# Altium schematic sheet Thermistor_Interface.SchDoc: Title
size B; Organization: Midnight Sun Solar Rayce Car Team; Address1: University of Waterloo; Address2: 200 University Ave W; Address3: Waterloo, ON, Canada; Address4: N2L 3E9; Website: www.uwmidsun.com; ProjectName: ProjectName
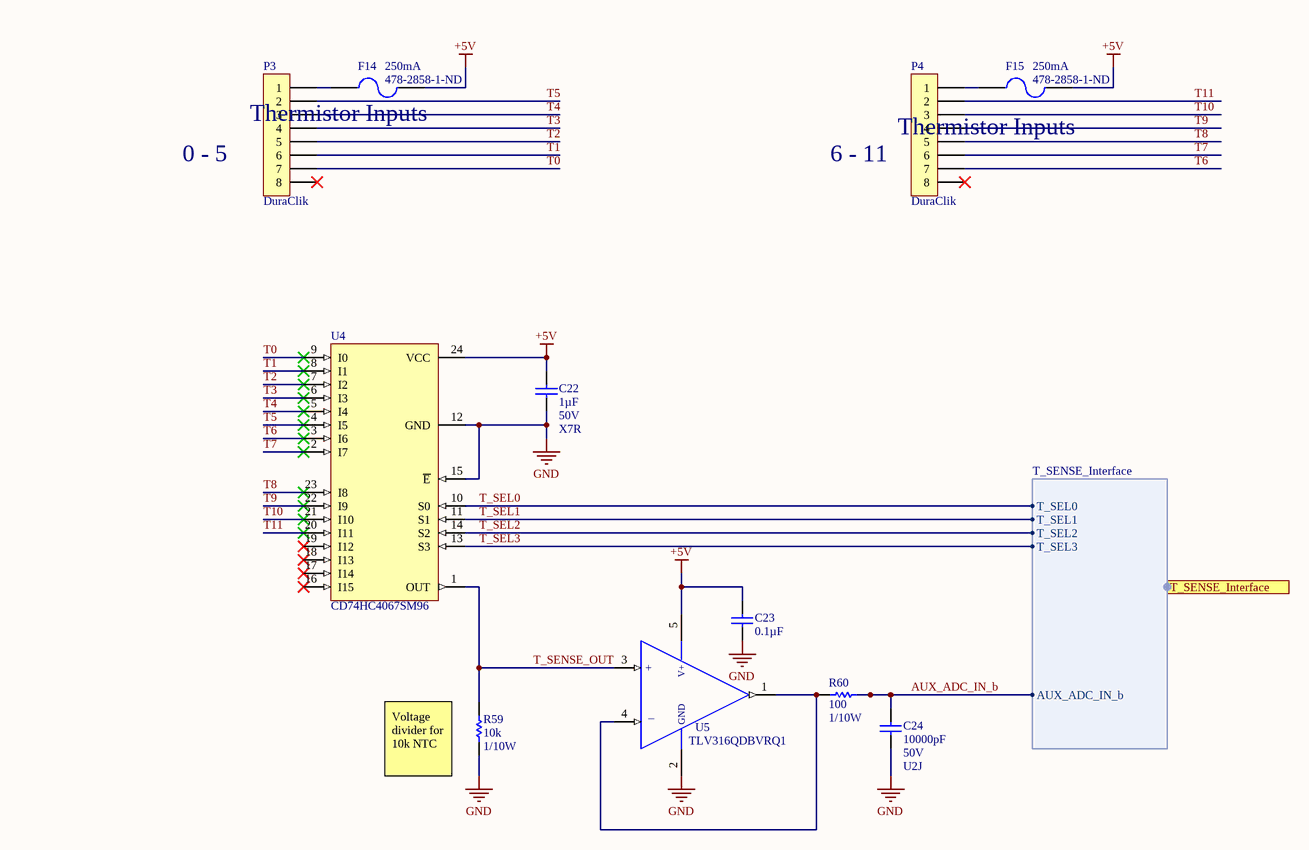
[diagram p0: Thermistor_Interface.SchDoc]

## Parts
C22  Capacitance: 1µF  Voltage: 50V  Temperature Coefficient: X7R  [CAP, 0603]  (hidden comment: CAP CER 1UF 50V 10% X7R 0603)
C23  Capacitance: 0.1µF  [CAP, 0603]  (hidden comment: CAP CER 0.1UF 50V 10% X7R 0603)
C24  Capacitance: 10000pF  Voltage: 50V  Temperature Coefficient: U2J  [CAP, 0603]  (hidden comment: CAP CER 10nF 50V 5% X7R 0603)
F14  Fuse Current: 250mA  Supplier Part Number 1: 478-2858-1-ND  [RES, 0603]  (hidden comment: FUSE 250MA 32VDC 0603)
F15  Fuse Current: 250mA  Supplier Part Number 1: 478-2858-1-ND  [RES, 0603]  (hidden comment: FUSE 250MA 32VDC 0603)
P3  Series: DuraClik  [CONN, 8POS Dura-Clik]  (hidden comment: CONN 8POS DURA-CLIK 0.079")
P4  Series: DuraClik  [CONN, 8POS Dura-Clik]  (hidden comment: CONN 8POS DURA-CLIK 0.079")
R59  Resistance: 10k  Power: 1/10W  [RES, 0603]  (hidden comment: RES 10K OHM 1% 1/10W 0603)
R60  Resistance: 100  Power: 1/10W  [RES, 0603]  (hidden comment: RES 100 OHM 1% 1/10W 0603)
U4  Manufacturer Part Number 1: CD74HC4067SM96  [SSOP-24_GN]  (hidden comment: IC MUX/DEMUX 1X16 24SSOP)
U5  Manufacturer Part Number 1: TLV316QDBVRQ1  [IC OP AMP GP RR 10MHZ SOT-23-5]  (hidden comment: IC OP AMP GEN PURPOSE RR 10MHZ SOT-23-5)

## Ports
T_SENSE_Interface (harness T_SENSE_Interface)

## Harnesses
T_SENSE_Interface: AUX_ADC_IN_b, T_SEL0, T_SEL1, T_SEL2, T_SEL3

## Nets
+5V: C22.1 C23.1 F14.2 F15.2 U4.24(VCC) U5.5(VDD)
GND: C22.2 C23.2 C24.2 R59.2 U4.12(GND) U4.15(~{E}) U5.2(VSS)
AUX_ADC_IN_b: C24.1 R60.2 ; port T_SENSE_Interface.AUX_ADC_IN_b
T0: P3.7 U4.9(I0)
T1: P3.6 U4.8(I1)
T2: P3.5 U4.7(I2)
T3: P3.4 U4.6(I3)
T4: P3.3 U4.5(I4)
T5: P3.2 U4.4(I5)
T6: P4.7 U4.3(I6)
T7: P4.6 U4.2(I7)
T8: P4.5 U4.23(I8)
T9: P4.4 U4.22(I9)
T10: P4.3 U4.21(I10)
T11: P4.2 U4.20(I11)
T_SEL0: U4.10(S0) ; port T_SENSE_Interface.T_SEL0
T_SEL1: U4.11(S1) ; port T_SENSE_Interface.T_SEL1
T_SEL2: U4.14(S2) ; port T_SENSE_Interface.T_SEL2
T_SEL3: U4.13(S3) ; port T_SENSE_Interface.T_SEL3
T_SENSE_OUT: R59.1 U4.1(OUT) U5.3(+IN)
NetF14_1: F14.1 P3.1
NetF15_1: F15.1 P4.1
NetR60_1: R60.1 U5.1(OUTPUT) U5.4(-IN)

Not connected (* = marked no-connect by the designer): P3 8*; P4 8*; U4 16(I15)* 17(I14)* 18(I13)* 19(I12)*

## Notes on the sheet
- 0 - 5
- (near P3) Thermistor Inputs
- 6 - 11
- (near P4) Thermistor Inputs
- (near R59) Voltage divider for 10k NTC
- PROJECT
- DOCUMENT
- DRAWN BY
- LAST MODIFIED
- PART NUMBER
- REVISION
- SHEET
- VARIANT
- OF
- Engineering 5 - 1002
  University of Waterloo
  (519) 888-4567 x32978
  hardware@uwmidsun.com
- (in symbol IC OP AMP GEN PURPOSE RR 10MHZ SOT-23-5) V+; +; GND; _

## Library data of the parts
C22 = CAP CER 1UF 50V 10% X7R 0603: 1µF ±10% 50V Ceramic Capacitor X7R 0603 (1608 Metric); Manufacturer 1: Taiyo Yuden; Manufacturer Part Number 1: UMK107AB7105KA-T; Supplier 1: Digi-Key; Supplier Part Number 1: 587-3247-1-ND; Packaging: Cut Tape (CT); Part Status: Active; Operating Temperature: -55°C ~ 125°C; Ratings: -; Mounting Type: Surface Mount, MLCC; Package / Case: 0603 (1608 Metric); Size / Dimension: 0.063" L x 0.031" W (1.60mm x 0.80mm); Height - Seated (Max): -; Thickness (Max): 0.037" (0.95mm); Lead Spacing: -; Lead Style: -; ComponentLink1URL: http://www.yuden.co.jp/productdata/catalog/en/mlcc_all_e.pdf; ComponentLink1Description: http://www.yuden.co.jp/productdata/catalog/en/mlcc_all_e.pdf; Tolerance: ±10%
C23 = CAP CER 0.1UF 50V 10% X7R 0603: 0.10µF ±10% 50V Ceramic Capacitor X7R 0603 (1608 Metric); Manufacturer 1: AVX Corporation; Manufacturer Part Number 1: 06035C104KAT2A; Supplier 1: Digi-Key; Supplier Part Number 1: 478-5052-1-ND; Packaging: Cut Tape (CT); Part Status: Active; Operating Temperature: -55°C ~ 125°C; Ratings: -; Mounting Type: Surface Mount, MLCC; Package / Case: 0603 (1608 Metric); Size / Dimension: 0.063" L x 0.032" W (1.60mm x 0.81mm); Height - Seated (Max): -; Thickness (Max): 0.035" (0.90mm); Lead Spacing: -; Lead Style: -; ComponentLink1URL: http://datasheets.avx.com/X7RDielectric.pdf; ComponentLink1Description: http://datasheets.avx.com/X7RDielectric.pdf; Tolerance: ±10%; Voltage: 50V; Temperature Coefficient: X7R
C24 = CAP CER 10nF 50V 5% X7R 0603: 10000pF ±5% 50V Ceramic Capacitor U2J 0603 (1608 Metric); Manufacturer 1: KEMET; Manufacturer Part Number 1: C0603C103J5JAC7867; Supplier 1: Digi-Key; Supplier Part Number 1: 399-13384-1-ND; Packaging: Cut Tape (CT); Part Status: Active; Operating Temperature: -55°C ~ 125°C; Ratings: -; Failure Rate: -; Mounting Type: Surface Mount, MLCC; Package / Case: 0603 (1608 Metric); Size / Dimension: 0.063" L x 0.032" W (1.60mm x 0.80mm); Height - Seated (Max): -; Thickness (Max): 0.034" (0.87mm); Lead Spacing: -; Lead Style: -; ComponentLink1URL: http://www.kemet.com/docfinder?Partnumber=C0603C103J5JAC7867; ComponentLink1Description: http://www.kemet.com/docfinder?Partnumber=C0603C103J5JAC7867; Tolerance: ±5%
F14 F15 = FUSE 250MA 32VDC 0603: Manufacturer: Kyocera AVX; Manufacturer Part Number: F0603E0R25FSTR; Voltage Rating (DC): 32V; Resistance: 650mR; Fuse Type: Board Mount (Cartridge Style Excluded); Approvals: UL; Supplier 1: Digi-Key; Stock 1: 48569; Pricing 1: 1=0.41, 5=0.394, 10=0.381, 50=0.3206, 100=0.2662, 250=0.242, 500=0.2057, 1000=0.1815 (USD); Mount: Surface Mount; Case/Package: 0603; Number of Pins: 2; Case Code (Metric): 1608; Case Code (Imperial): 0603; Contact Plating: Tin,Matte; Terminal Material: Nickel; Min Operating Temperature: -55°C; Max Operating Temperature: 125°C; Package Quantity: 1; Current Rating: 250mA; Packaging: Tape and Reel; Voltage Rating: 32V; Voltage Rating (AC): 32V; Max Voltage Rating (DC): 32V; DC Cold Resistance: 650mR; Composition: Thin Film; Length: 1.6mm; Height: 0.63mm; Width: 0.81mm; Depth: 0.81mm; Radiation Hardening: No; REACH SVHC: No SVHC; Lead Free: Lead Free; ComponentLink1URL: https://datasheet.ciiva.com/301/accug2-301328.pdf; ComponentLink1Description: https://datasheet.ciiva.com/301/accug2-301328.pdf; ComponentLink2URL: https://datasheet.ciiva.com/301/accug2-301329.pdf; ComponentLink2Description: https://datasheet.ciiva.com/301/accug2-301329.pdf; ComponentLink3URL: https://datasheet.ciiva.com/7650/accugrd-7650774.pdf; ComponentLink3Description: https://datasheet.ciiva.com/7650/accugrd-7650774.pdf; ComponentLink4URL: https://datasheet.ciiva.com/28473/1819437-28473548.pdf; ComponentLink4Description: https://datasheet.ciiva.com/28473/1819437-28473548.pdf; ComponentLink5URL: https://datasheet.ciiva.com/301/accug2-301327.pdf; ComponentLink5Description: https://datasheet.ciiva.com/301/accug2-301327.pdf
P3 P4 = CONN 8POS DURA-CLIK 0.079": 8 Positions Header Connector 0.079" (2.00mm) Surface Mount Tin; Manufacturer 1: Molex, LLC; Manufacturer Part Number 1: 5600200820; Style: Board to Cable/Wire; Shrouding: Shrouded - 4 Wall; Number of Positions: 8; Number of Positions Loaded: All; Mated Stacking Heights: 9.3mm; Supplier 1: Digi-Key; Supplier Part Number 1: WM10868CT-ND; Packaging: Cut Tape (CT); Part Status: Active; Connector Type: Header; Contact Type: Male Pin; Pitch - Mating: 0.079" (2.00mm); Number of Rows: 1; Row Spacing - Mating: -; Mounting Type: Surface Mount; Termination: Solder; Fastening Type: Latch Lock; Contact Length - Mating: -; Contact Length - Post: -; Overall Contact Length: -; Insulation Height: 0.315" (8.00mm); Contact Shape: Square; Contact Finish - Mating: Tin; Contact Finish Thickness - Mating: -; Contact Finish - Post: Tin; Contact Material: Copper Alloy; Insulation Material: Polyamide (PA), Nylon; Operating Temperature: -; Ingress Protection: -; Material Flammability Rating: -; Insulation Color: Natural; Current Rating: -; Contact Finish Thickness - Post: -; ComponentLink1URL: http://www.molex.com/pdm_docs/sd/5600200820_sd.pdf; ComponentLink1Description: http://www.molex.com/pdm_docs/sd/5600200820_sd.pdf; Voltage: -
R59 = RES 10K OHM 1% 1/10W 0603: RES SMD 10K OHM 1% 1/10W 0603; Manufacturer 1: Yageo; Manufacturer Part Number 1: RC0603FR-0710KL; Temperature Coefficient: ±100ppm/°C; Supplier 1: Digi-Key; Supplier Part Number 1: 311-10.0KHRCT-ND; Packaging: Cut Tape (CT); Part Status: Active; Composition: Thick Film; Operating Temperature: -55°C ~ 155°C; Package / Case: 0603 (1608 Metric); Supplier Device Package: 0603; Size / Dimension: 0.063" L x 0.031" W (1.60mm x 0.80mm); Height - Seated (Max): 0.022" (0.55mm); Failure Rate: -; ComponentLink1URL: http://www.yageo.com/documents/recent/PYu-RC_Group_51_RoHS_L_7.pdf; ComponentLink1Description: http://www.yageo.com/documents/recent/PYu-RC_Group_51_RoHS_L_7.pdf; Tolerance: ±1%
R60 = RES 100 OHM 1% 1/10W 0603: 100 Ohm ±1% 0.1W, 1/10W Chip Resistor 0603 (1608 Metric) Moisture Resistant Thick Film; Manufacturer 1: Yageo; Manufacturer Part Number 1: RC0603FR-07100RL; Temperature Coefficient: ±100ppm/°C; Supplier 1: Digi-Key; Supplier Part Number 1: 311-100HRCT-ND; Packaging: Cut Tape (CT); Part Status: Active; Composition: Thick Film; Operating Temperature: -55°C ~ 155°C; Package / Case: 0603 (1608 Metric); Supplier Device Package: 0603; Size / Dimension: 0.063" L x 0.031" W (1.60mm x 0.80mm); Height - Seated (Max): 0.022" (0.55mm); Failure Rate: -; ComponentLink1URL: http://www.yageo.com/documents/recent/PYu-RC_Group_51_RoHS_L_7.pdf; ComponentLink1Description: http://www.yageo.com/documents/recent/PYu-RC_Group_51_RoHS_L_7.pdf; Tolerance: ±1%
U4 = IC MUX/DEMUX 1X16 24SSOP: 1 Circuit IC Switch 16:1 160 Ohm 24-SSOP; Manufacturer 1: Texas Instruments; Number of Circuits: 1; On-State Resistance (Max): 160 Ohm; Channel-to-Channel Matching (&Delta;Ron): 8.5 Ohm; Voltage - Supply, Single (V+): 2 V ~ 6 V; Switch Time (Ton, Toff) (Max): 51ns, 49ns; -3db Bandwidth: 89MHz; Channel Capacitance (CS(off), CD(off)): 5pF, 50pF; Current - Leakage (IS(off)) (Max): 800nA; Supplier 1: Digi-Key; Supplier Part Number 1: 296-9226-1-ND; Packaging: Cut Tape (CT); Part Status: Active; Switch Circuit: -; Multiplexer/Demultiplexer Circuit: 16:1; Voltage - Supply, Dual (V±): -; Charge Injection: -; Crosstalk: -; Operating Temperature: -55°C ~ 125°C (TA); Package / Case: 24-SSOP (0.209", 5.30mm Width); Supplier Device Package: 24-SSOP; ComponentLink1URL: http://www.ti.com/lit/ds/symlink/cd74hc4067.pdf; ComponentLink1Description: http://www.ti.com/lit/ds/symlink/cd74hc4067.pdf
U5 = IC OP AMP GEN PURPOSE RR 10MHZ SOT-23-5: General Purpose Amplifier 1 Circuit Rail-to-Rail SOT-23-5; Manufacturer 1: Texas Instruments; Description 1: IC OP AMP GP RR 10MHZ 5-SOT-23; Number of Circuits: 1; Slew Rate: 6 V/µs; Current - Supply: 400µA; Current - Output / Channel: 50mA; Voltage - Supply, Single/Dual (±): 1.8 V ~ 5.5 V, ±0.9 V ~ 2.75 V; Supplier 1: Digi-Key; Supplier Part Number 1: 296-45323-1-ND; RoHS: RoHS Compliant; Category: Integrated Circuits (ICs); Stock 1: 1747; Pricing 1: 1=1.33, 10=1.185, 100=0.9234, 500=0.76276, 1000=0.60218 (CAD); Packaging: Cut Tape (CT); Part Status: Active; Amplifier Type: General Purpose; Output Type: Rail-to-Rail; -3db Bandwidth: -; Operating Temperature: -40°C ~ 125°C; Mounting Type: Surface Mount; Package / Case: SC-74A, SOT-753; Supplier Device Package: SOT-23-5; ComponentLink1URL: http://www.ti.com/lit/ds/symlink/tlv316-q1.pdf; ComponentLink1Description: http://www.ti.com/lit/ds/symlink/tlv316-q1.pdf